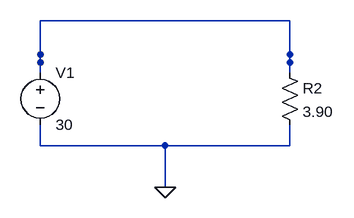
[diagram p0: schematic pannel2.asc]
pannel2.asc, the LTspice schematic file:
Version 4
SHEET 1 880 680
WIRE 704 400 704 372
WIRE 704 512 704 480
SYMBOL res 688 384 R0
SYMATTR InstName R2
SYMATTR Value 3.90
FLAG 512 576 0
WIRE 320 400 320 372
WIRE 320 512 320 480
SYMBOL voltage 320 384 R0
SYMATTR InstName V1
SYMATTR Value 30
WIRE 512 320 576 320
WIRE 448 320 512 320
WIRE 320 320 320 384
WIRE 320 320 384 320
WIRE 704 320 704 384
WIRE 640 320 704 320
WIRE 640 512 704 512
WIRE 512 512 512 576
WIRE 512 512 576 512
WIRE 448 512 512 512
WIRE 320 512 384 512
WIRE 576 512 640 512
WIRE 384 512 448 512
WIRE 384 320 448 320
WIRE 576 320 640 320

The netlist it stands for:
* pannel2.asc
R2 N001 0 3.90
V1 N001 0 30
.backanno
.end